# Altium schematic sheet BBB_Cape.SchDoc: Krapong-ROV, F-Tube (BBB)
size A4; DocumentNumber: 1; Revision: 1.0; SheetNumber: 2; SheetTotal: 4; PageSetup: Record=PageOptions|CenterHorizontal=True|CenterVertical=True|PrintScale=0.97|XCorrection=1.00|YCorrection=1.00|PrintKind=0|BorderSize=5000000|LeftOffset=0|BottomOffset=0|Orientation=2|PaperLength=1000|PaperWidth=1000|Scale=100|PaperSource=7|PrintQuality=-3|MediaType=1|DitherType=10|PrintScaleMode=1|PaperKind=A4|PaperIndex=9; Rule: PcbType=ProtelPcb
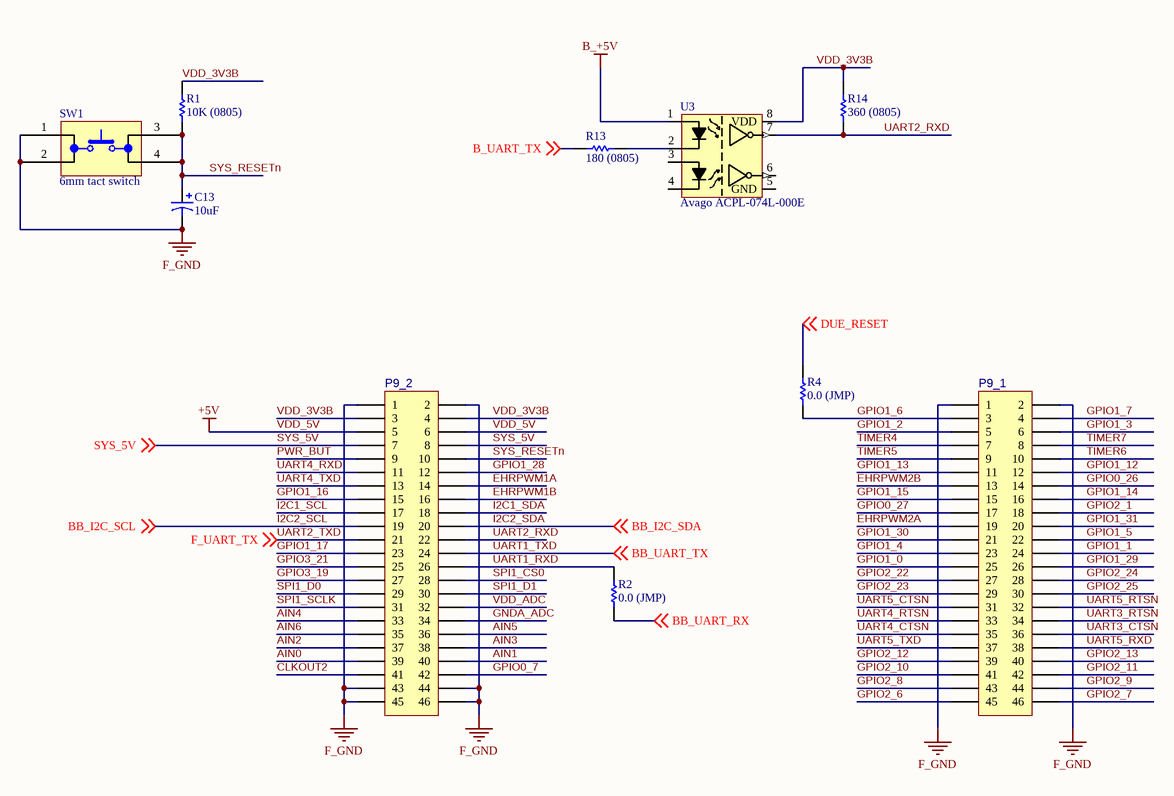
[diagram p0: BBB_Cape.SchDoc]

## Parts
C13  10uF  [PCB-ibkib54e90xysjsqnert-1]
P9_1  Major League Electronics TSHC-123-D-06-240-GT-LF  [PCB-44amy4d7xro60oo8ojyx-1]  (value not drawn)
P9_2  Major League Electronics TSHC-123-D-06-240-GT-LF  [PCB-44amy4d7xro60oo8ojyx-1]  (value not drawn)
R1  10K (0805)  [RESC2013X60X40NL15T20]
R2  0.0 (JMP)  [RESC2013X60X35ML10T20]
R4  0.0 (JMP)  [RESC2013X60X35ML10T20]
R13  180 (0805)  [RESC2013X60X40NL15T20]
R14  360 (0805)  [RESC2013X60X40NL15T20]
SW1  6mm tact switch  [PCB-gaic1pl4705ifv3nefaq-1]
U3  Avago ACPL-074L-000E  [PCB-tvxoajnlj650fdg499ex-1]

## Nets
B_+5V: U3.1
F_GND: C13.2 P9_1.1 P9_1.2 P9_2.1 P9_2.2 P9_2.43 P9_2.44 P9_2.45 P9_2.46 SW1.1 SW1.2
VDD_5V: P9_2.5 P9_2.6  [also labelled +5V]
AIN0: P9_2.39
AIN1: P9_2.40
AIN2: P9_2.37
AIN3: P9_2.38
AIN4: P9_2.33
AIN5: P9_2.36
AIN6: P9_2.35
B_UART_TX: R13.2 ; off-sheet B_UART_TX
BB_UART_RX: R2.1 ; off-sheet BB_UART_RX
CLKOUT2: P9_2.41
DUE_RESET: R4.2 ; off-sheet DUE_RESET
EHRPWM1A: P9_2.14
EHRPWM1B: P9_2.16
EHRPWM2A: P9_1.19
EHRPWM2B: P9_1.13
GNDA_ADC: P9_2.34
GPIO0_7: P9_2.42
GPIO0_26: P9_1.14
GPIO0_27: P9_1.17
GPIO1_0: P9_1.25
GPIO1_1: P9_1.24
GPIO1_2: P9_1.5
GPIO1_3: P9_1.6
GPIO1_4: P9_1.23
GPIO1_5: P9_1.22
GPIO1_6: P9_1.3 R4.1
GPIO1_7: P9_1.4
GPIO1_12: P9_1.12
GPIO1_13: P9_1.11
GPIO1_14: P9_1.16
GPIO1_15: P9_1.15
GPIO1_16: P9_2.15
GPIO1_17: P9_2.23
GPIO1_28: P9_2.12
GPIO1_29: P9_1.26
GPIO1_30: P9_1.21
GPIO1_31: P9_1.20
GPIO2_1: P9_1.18
GPIO2_6: P9_1.45
GPIO2_7: P9_1.46
GPIO2_8: P9_1.43
GPIO2_9: P9_1.44
GPIO2_10: P9_1.41
GPIO2_11: P9_1.42
GPIO2_12: P9_1.39
GPIO2_13: P9_1.40
GPIO2_22: P9_1.27
GPIO2_23: P9_1.29
GPIO2_24: P9_1.28
GPIO2_25: P9_1.30
GPIO3_19: P9_2.27
GPIO3_21: P9_2.25
I2C1_SCL: P9_2.17
I2C1_SDA: P9_2.18
I2C2_SCL: P9_2.19 ; off-sheet BB_I2C_SCL  [also labelled BB_I2C_SCL]
I2C2_SDA: P9_2.20 ; off-sheet BB_I2C_SDA  [also labelled BB_I2C_SDA]
PWR_BUT: P9_2.9
SPI1_CS0: P9_2.28
SPI1_D0: P9_2.29
SPI1_D1: P9_2.30
SPI1_SCLK: P9_2.31
SYS_5V: P9_2.7 P9_2.8 ; off-sheet SYS_5V
SYS_RESETn: C13.1 P9_2.10 R1.1 SW1.3 SW1.4
TIMER4: P9_1.7
TIMER5: P9_1.9
TIMER6: P9_1.10
TIMER7: P9_1.8
UART1_RXD: P9_2.26 R2.2
UART1_TXD: P9_2.24 ; off-sheet BB_UART_TX  [also labelled BB_UART_TX]
UART2_RXD: P9_2.22 R14.2 U3.7
UART2_TXD: P9_2.21 ; off-sheet F_UART_TX  [also labelled F_UART_TX]
UART3_CTSN: P9_1.36
UART3_RTSN: P9_1.34
UART4_CTSN: P9_1.35
UART4_RTSN: P9_1.33
UART4_RXD: P9_2.11
UART4_TXD: P9_2.13
UART5_CTSN: P9_1.31
UART5_RTSN: P9_1.32
UART5_RXD: P9_1.38
UART5_TXD: P9_1.37
VDD_3V3B: P9_2.3 P9_2.4 R1.2 R14.1 U3.8(VDD)
VDD_ADC: P9_2.32
NetR13_1: R13.1 U3.2

Not connected (* = marked no-connect by the designer): U3 3 4 5(GND) 6

## Notes on the sheet
- Title
- Size:
- Date:
- A4
- Number:
- Time:
- Revision:
- Sheet
- of
- Designer:
- Siwakorn Sukprasertchai
- Marine Electrical Laboratory
- IMS, KU SRC
- File:

## Library data of the parts
C13 = CMP-da8810cd3d6e054f-2: Capacitor Alum Elec, 10uf, 100v, 20%, Capacitor Alum Elec, 10uf, 100v, 20%, Smd, Full Reel; Manufacturer Part Number: EEE-2AA100UP; Capacitance: 10.0 µF; Lead-Free Status: Lead Free; RoHS: Compliant; Octopart URL: http://octopart.com/eee-2aa100up-panasonic-55558784; Lifecycle Status: Not Listed by Manufacturer; Capacitance Tolerance: ±20%; Packaging: Cut Tape (CT); Mounting Style: Surface Mount; Size-Height: 6.20 mm; Voltage Rating (DC): 100 V; REACH SVHC Compliance: No SVHC; Size-Diameter: 8.00 mm; OctopartID: da8810cd3d6e054f
P9_1 P9_2 = CMP-5fc8970d5e37800f-3: TSHC series 46 position 2.54 mm straight Thru Hole Connector; Lead-Free Status: Lead Free; Octopart URL: http://octopart.com/tshc-123-d-06-240-gt-lf-major+league+electronics-30352537; OctopartID: 5fc8970d5e37800f; Manufacturer Part Number: TSHC-123-D-06-240-GT-LF; RoHS: Compliant
R1 R13 R14 = CMP-1860549-2: RES SMD 10K OHM 1% 1/3W 0805; Lead-Free Status: Lead Free; Power Rating: 0.125 W; Resistance: 10000.0 ?; Voltage Rating (DC): 150.0 V; Case/Package: 0805; Mounting Style: Surface Mount; Number of Pins: 2; Octopart Url: https://octopart.com/crcw080510k0fkeahp-vishay-42634554; OctopartID: fa6931e9523525ae; Packaging: Cut Tape (CT); REACH SVHC Compliance: No SVHC; Resistance Tolerance: ±1%; RoHS: Compliant
R2 R4 = CMP-1875921-8: Res Thick Film 0805 0 Ohm Molded SMD Paper T/R; Manufacturer Part Number: RC0805FR-070RL; Resistance: 0.0 ?; Lead-Free Status: Lead Free; Resistance Tolerance: ±1%; OctopartID: f3d13a5618eb2c16; Case/Package: 0805; Octopart Url: https://octopart.com/rc0805fr-070rl-yageo-9293404; Mounting Style: Surface Mount; RoHS: Compliant
SW1 = CMP-3ee8f78971b1e12f-10: Switch Tactile OFF (ON) SPST Round Button PC Pins 0.05A 24VDC 100000Cycles 1.57N Thru-Hole Loose; Manufacturer Part Number: 1825910-6; ELV Compliant: Compliant; Lead-Free Status: Lead Free; Contact Plating: Silver; Contact Material: Copper Alloy; Lifecycle Status: Active; Mounting Style: Through Hole; Octopart URL: http://octopart.com/1825910-6-te+connectivity+%2F+amp-7039551; OctopartID: 3ee8f78971b1e12f; RoHS: Compliant
U3 = CMP-ee2b274cae1231ec-3: Optocoupler Logic-Out Push-Pull DC-IN 2-CH 8-Pin SOIC Tube; Lead-Free Status: Lead Free; Output Voltage: 6.50 V; Input Current: 18.0 mA; Isolation Voltage: 3.75 kV; Number of Pins: 8; Packaging: Tube; Octopart URL: http://octopart.com/acpl-074l-000e-avago-7169375; Manufacturer Part Number: ACPL-074L-000E; REACH SVHC Compliance: No SVHC; Lifecycle Status: Active; RoHS: Compliant; Mounting Style: Surface Mount; OctopartID: ee2b274cae1231ec